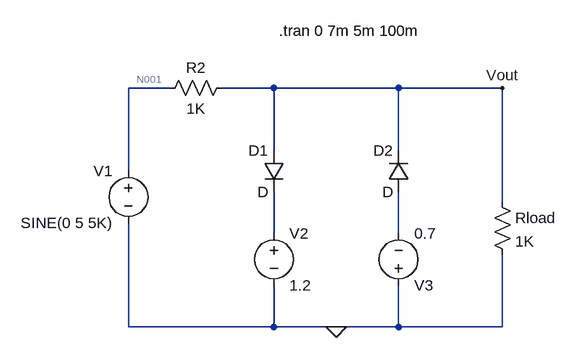
[diagram p0: schematic Apartado_A.asc]
Apartado_A.asc, the LTspice schematic file:
Version 4
SHEET 1 880 680
WIRE 16 32 -48 32
WIRE 176 32 96 32
WIRE 368 32 176 32
WIRE 528 32 368 32
WIRE 176 128 176 32
WIRE 368 128 368 32
WIRE -48 160 -48 32
WIRE 528 208 528 32
WIRE 176 256 176 192
WIRE 368 256 368 192
WIRE -48 400 -48 240
WIRE 176 400 176 336
WIRE 176 400 -48 400
WIRE 272 400 176 400
WIRE 368 400 368 336
WIRE 368 400 272 400
WIRE 528 400 528 288
WIRE 528 400 368 400
FLAG 272 400 0
FLAG 528 32 Vout
SYMBOL diode 192 128 M0
SYMATTR InstName D1
SYMBOL diode 384 192 R180
WINDOW 0 24 64 Left 2
WINDOW 3 24 0 Left 2
SYMATTR InstName D2
SYMBOL res 512 192 R0
SYMATTR InstName Rload
SYMATTR Value 1K
SYMBOL res 112 16 R90
WINDOW 0 0 56 VBottom 2
WINDOW 3 32 56 VTop 2
SYMATTR InstName R2
SYMATTR Value 1K
SYMBOL voltage -48 144 M0
WINDOW 123 0 0 Left 2
WINDOW 39 0 0 Left 2
SYMATTR InstName V1
SYMATTR Value SINE(0 5 5K)
SYMBOL voltage 176 240 R0
WINDOW 123 0 0 Left 2
WINDOW 39 0 0 Left 2
SYMATTR InstName V2
SYMATTR Value 1.2
SYMBOL voltage 368 352 M180
WINDOW 123 0 0 Left 2
WINDOW 39 0 0 Left 2
SYMATTR InstName V3
SYMATTR Value 0.7
TEXT 184 -56 Left 2 !.tran 0 7m 5m 100m

The netlist it stands for:
* Apartado_A.asc
D1 Vout N002 D
D2 N003 Vout D
Rload Vout 0 1K
R2 Vout N001 1K
V1 N001 0 SINE(0 5 5K)
V2 N002 0 1.2
V3 0 N003 0.7
.model D D
.lib standard.dio
.tran 0 7m 5m 100m
.backanno
.end

* Results of the author's LTspice run, read from the files saved beside the schematic
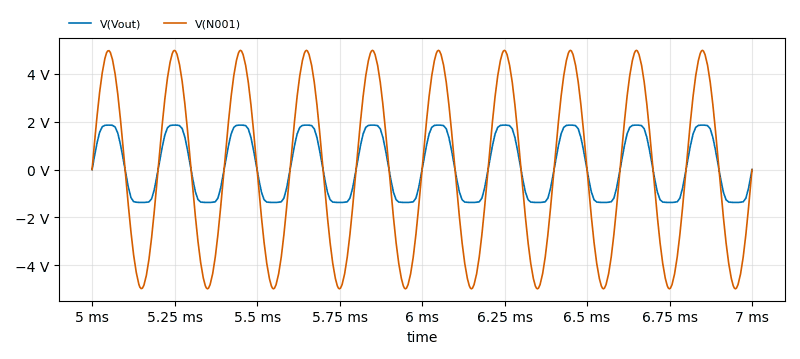
[diagram p1: Transient Analysis of Apartado_A.asc, plotted from the saved traces]
* Transient Analysis, 1 run:
*   V(Vout): min -1.376 V, max 1.861 V, average 135.1 mV, rms 1.33 V, last 0 V
*   V(N001): min -4.987 V, max 4.988 V, average 58.73 µV, rms 3.502 V, last 0 V